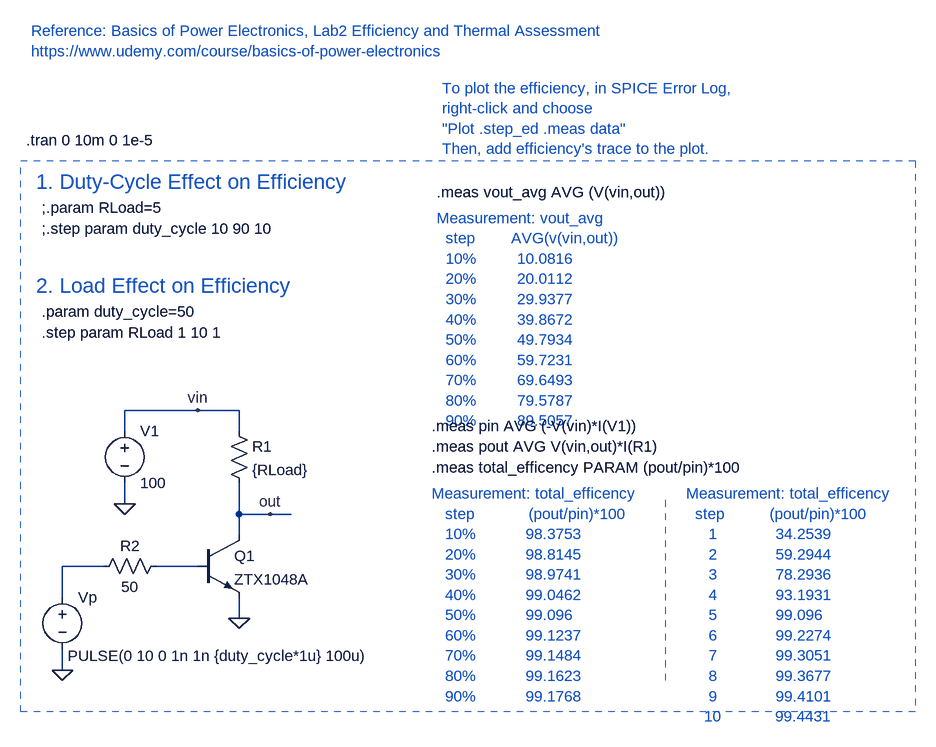
[diagram p0: schematic 14-npn_chopper_efficiency.asc]
14-npn_chopper_efficiency.asc, the LTspice schematic file:
Version 4
SHEET 1 1760 1716
WIRE 304 336 192 336
WIRE 368 336 304 336
WIRE 192 368 192 336
WIRE 368 368 368 336
WIRE 192 480 192 448
WIRE 368 496 368 448
WIRE 416 496 368 496
WIRE 448 496 416 496
WIRE 368 528 368 496
WIRE 160 576 96 576
WIRE 304 576 240 576
WIRE 96 624 96 576
WIRE 368 656 368 624
WIRE 96 736 96 704
FLAG 192 480 0
FLAG 96 736 0
FLAG 368 656 0
FLAG 416 496 out
FLAG 304 336 vin
SYMBOL voltage 192 352 R0
WINDOW 123 0 0 Left 0
WINDOW 39 0 0 Left 0
SYMATTR InstName V1
SYMATTR Value 100
SYMBOL voltage 96 608 R0
WINDOW 3 8 106 Left 2
WINDOW 123 0 0 Left 0
WINDOW 39 0 0 Left 0
SYMATTR InstName Vp
SYMATTR Value PULSE(0 10 0 1n 1n {duty_cycle*1u} 100u)
SYMBOL res 256 560 R90
WINDOW 0 0 56 VBottom 2
WINDOW 3 32 56 VTop 2
SYMATTR InstName R2
SYMATTR Value 50
SYMBOL npn 304 528 R0
SYMATTR InstName Q1
SYMATTR Value ZTX1048A
SYMBOL res 352 352 R0
SYMATTR InstName R1
SYMATTR Value {RLoad}
TEXT 40 -80 Left 2 !.tran 0 10m 0 1e-5
TEXT 48 -248 Left 2 ;Reference: Basics of Power Electronics, Lab2 Efficiency and Thermal Assessment\nhttps://www.udemy.com/course/basics-of-power-electronics
TEXT 64 56 Left 2 !;.step param duty_cycle 10 90 10
TEXT 672 0 Left 2 !.meas vout_avg AVG (V(vin,out))
TEXT 672 40 Left 2 ;Measurement: vout_avg\n  step        AVG(v(vin,out))\n  10%         10.0816\n  20%         20.0112\n  30%         29.9377\n  40%         39.8672\n  50%         49.7934 \n  60%         59.7231 \n  70%         69.6493 \n  80%         79.5787\n  90%         89.5057
TEXT 664 360 Left 2 !.meas pin AVG (-V(vin)*I(V1))
TEXT 664 392 Left 2 !.meas pout AVG V(vin,out)*I(R1)
TEXT 664 424 Left 2 !.meas total_efficency PARAM (pout/pin)*100
TEXT 664 464 Left 2 ;Measurement: total_efficency\n   step            (pout/pin)*100\n   10%           98.3753\n   20%           98.8145\n   30%           98.9741\n   40%           99.0462\n   50%           99.096\n   60%           99.1237\n   70%           99.1484\n   80%           99.1623\n   90%           99.1768
TEXT 56 -16 Left 3 ;1. Duty-Cycle Effect on Efficiency
TEXT 680 -160 Left 2 ;To plot the efficiency, in SPICE Error Log, \nright-click and choose\n"Plot .step_ed .meas data"\nThen, add efficiency's trace to the plot.
TEXT 56 144 Left 3 ;2. Load Effect on Efficiency
TEXT 64 184 Left 2 !.param duty_cycle=50
TEXT 64 24 Left 2 !;.param RLoad=5
TEXT 64 216 Left 2 !.step param RLoad 1 10 1
TEXT 1056 464 Left 2 ;Measurement: total_efficency\n  step          (pout/pin)*100\n     1             34.2539\n     2             59.2944\n     3             78.2936\n     4             93.1931\n     5             99.096\n     6             99.2274\n     7             99.3051\n     8             99.3677\n     9             99.4101\n    10            99.4431
LINE Normal 1024 752 1024 464 1
RECTANGLE Normal 1408 800 32 -48 1

The netlist it stands for:
* 14-npn_chopper_efficiency.asc
V1 vin 0 100
Vp N001 0 PULSE(0 10 0 1n 1n {duty_cycle*1u} 100u)
R2 N002 N001 50
Q1 out N002 0 0 ZTX1048A
R1 vin out {RLoad}
.model NPN NPN
.model PNP PNP
.lib standard.bjt
.tran 0 10m 0 1e-5
* Reference: Basics of Power Electronics, Lab2 Efficiency and Thermal Assessment
* https://www.udemy.com/course/basics-of-power-electronics
;.step param duty_cycle 10 90 10
.meas vout_avg AVG (V(vin,out))
* Measurement: vout_avg
*   step        AVG(v(vin,out))
*   10%         10.0816
*   20%         20.0112
*   30%         29.9377
*   40%         39.8672
*   50%         49.7934
*   60%         59.7231
*   70%         69.6493
*   80%         79.5787
*   90%         89.5057
.meas pin AVG (-V(vin)*I(V1))
.meas pout AVG V(vin,out)*I(R1)
.meas total_efficency PARAM (pout/pin)*100
* Measurement: total_efficency
*    step            (pout/pin)*100
*    10%           98.3753
*    20%           98.8145
*    30%           98.9741
*    40%           99.0462
*    50%           99.096
*    60%           99.1237
*    70%           99.1484
*    80%           99.1623
*    90%           99.1768
* 1. Duty-Cycle Effect on Efficiency
* To plot the efficiency, in SPICE Error Log,
* right-click and choose
* "Plot .step_ed .meas data"
* Then, add efficiency's trace to the plot.
* 2. Load Effect on Efficiency
.param duty_cycle=50
;.param RLoad=5
.step param RLoad 1 10 1
* Measurement: total_efficency
*   step          (pout/pin)*100
*      1             34.2539
*      2             59.2944
*      3             78.2936
*      4             93.1931
*      5             99.096
*      6             99.2274
*      7             99.3051
*      8             99.3677
*      9             99.4101
*     10            99.4431
.backanno
.end